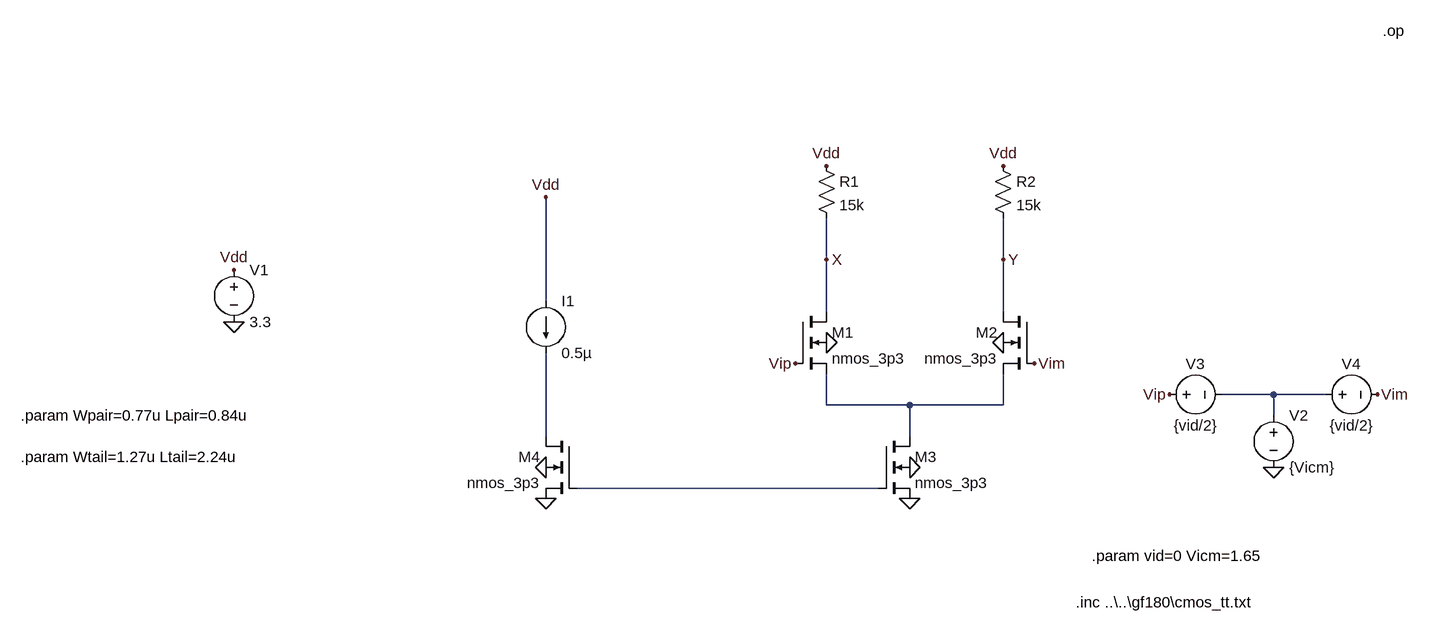
[diagram p0: schematic Draft6.asc]
Draft6.asc, the LTspice schematic file:
Version 4
SHEET 1 1764 680
WIRE 208 96 208 32
WIRE 480 96 480 32
WIRE -224 160 -224 0
WIRE 208 176 208 96
WIRE 480 176 480 96
WIRE 896 304 816 304
WIRE 976 304 896 304
WIRE 208 320 208 272
WIRE 336 320 208 320
WIRE 480 320 480 272
WIRE 480 320 336 320
WIRE 896 336 896 304
WIRE -224 368 -224 240
WIRE 336 368 336 320
WIRE 288 448 -176 448
FLAG 336 464 0
FLAG 208 224 0
FLAG 480 224 0
FLAG 336 416 0
FLAG -224 464 0
FLAG -224 416 0
FLAG -224 0 Vdd
FLAG 208 96 X
FLAG 480 96 Y
FLAG -704 192 0
FLAG -704 112 Vdd
FLAG 208 -48 Vdd
FLAG 480 -48 Vdd
FLAG 896 416 0
FLAG 736 304 Vip
FLAG 1056 304 Vim
FLAG 160 256 Vip
FLAG 528 256 Vim
SYMBOL nmos4 160 176 R0
SYMATTR InstName M1
SYMATTR Value nmos_3p3
SYMBOL nmos4 528 176 M0
SYMATTR InstName M2
SYMATTR Value nmos_3p3
SYMBOL nmos4 288 368 R0
SYMATTR InstName M3
SYMATTR Value nmos_3p3
SYMATTR Value2 l='Ltail' w='Wtail' m=1
SYMBOL nmos4 -176 368 M0
SYMATTR InstName M4
SYMATTR Value nmos_3p3
SYMATTR Value2 l='Ltail' w='Wtail' m=4
SYMBOL current -224 160 R0
WINDOW 123 0 0 Left 0
WINDOW 39 0 0 Left 0
SYMATTR InstName I1
SYMATTR Value 0.5µ
SYMBOL voltage -704 96 R0
WINDOW 123 0 0 Left 0
WINDOW 39 0 0 Left 0
SYMATTR InstName V1
SYMATTR Value 3.3
SYMBOL res 192 -64 R0
SYMATTR InstName R1
SYMATTR Value 15k
SYMBOL res 464 -64 R0
SYMATTR InstName R2
SYMATTR Value 15k
SYMBOL voltage 896 320 R0
WINDOW 123 0 0 Left 0
WINDOW 39 0 0 Left 0
SYMATTR InstName V2
SYMATTR Value {Vicm}
SYMBOL voltage 720 304 R270
WINDOW 0 32 56 VTop 2
WINDOW 3 -32 56 VBottom 2
SYMATTR InstName V3
SYMATTR Value {vid/2}
SYMBOL voltage 960 304 R270
WINDOW 0 32 56 VTop 2
WINDOW 3 -32 56 VBottom 2
SYMATTR InstName V4
SYMATTR Value {vid/2}
TEXT -1032 336 Left 2 !.param Wpair=0.77u Lpair=0.84u
TEXT -1032 400 Left 2 !.param Wtail=1.27u Ltail=2.24u
TEXT 616 552 Left 2 !.param vid=0 Vicm=1.65
TEXT 592 624 Left 2 !.inc ..\\..\\gf180\\cmos_tt.txt
TEXT 1064 -256 Left 2 !.op

The netlist it stands for:
* Draft6.asc
M1 X Vip N002 0 nmos_3p3
M2 Y Vim N002 0 nmos_3p3
M3 N002 N004 0 0 nmos_3p3 l='Ltail' w='Wtail' m=1
M4 N003 N004 0 0 nmos_3p3 l='Ltail' w='Wtail' m=4
I1 Vdd N003 0.5µ
V1 Vdd 0 3.3
R1 Vdd X 15k
R2 Vdd Y 15k
V2 N001 0 {Vicm}
V3 Vip N001 {vid/2}
V4 N001 Vim {vid/2}
.model NMOS NMOS
.model PMOS PMOS
.lib standard.mos
.param Wpair=0.77u Lpair=0.84u
.param Wtail=1.27u Ltail=2.24u
.param vid=0 Vicm=1.65
.inc ..\..\gf180\cmos_tt.txt
.op
.backanno
.end